# EAGLE schematic EEZ DIB DCM220 r2B8 (EAGLE 7.2.0)
Assembly variants: Farnell, TME

## Sheet 1 of 4: Bias PS, DIB interface
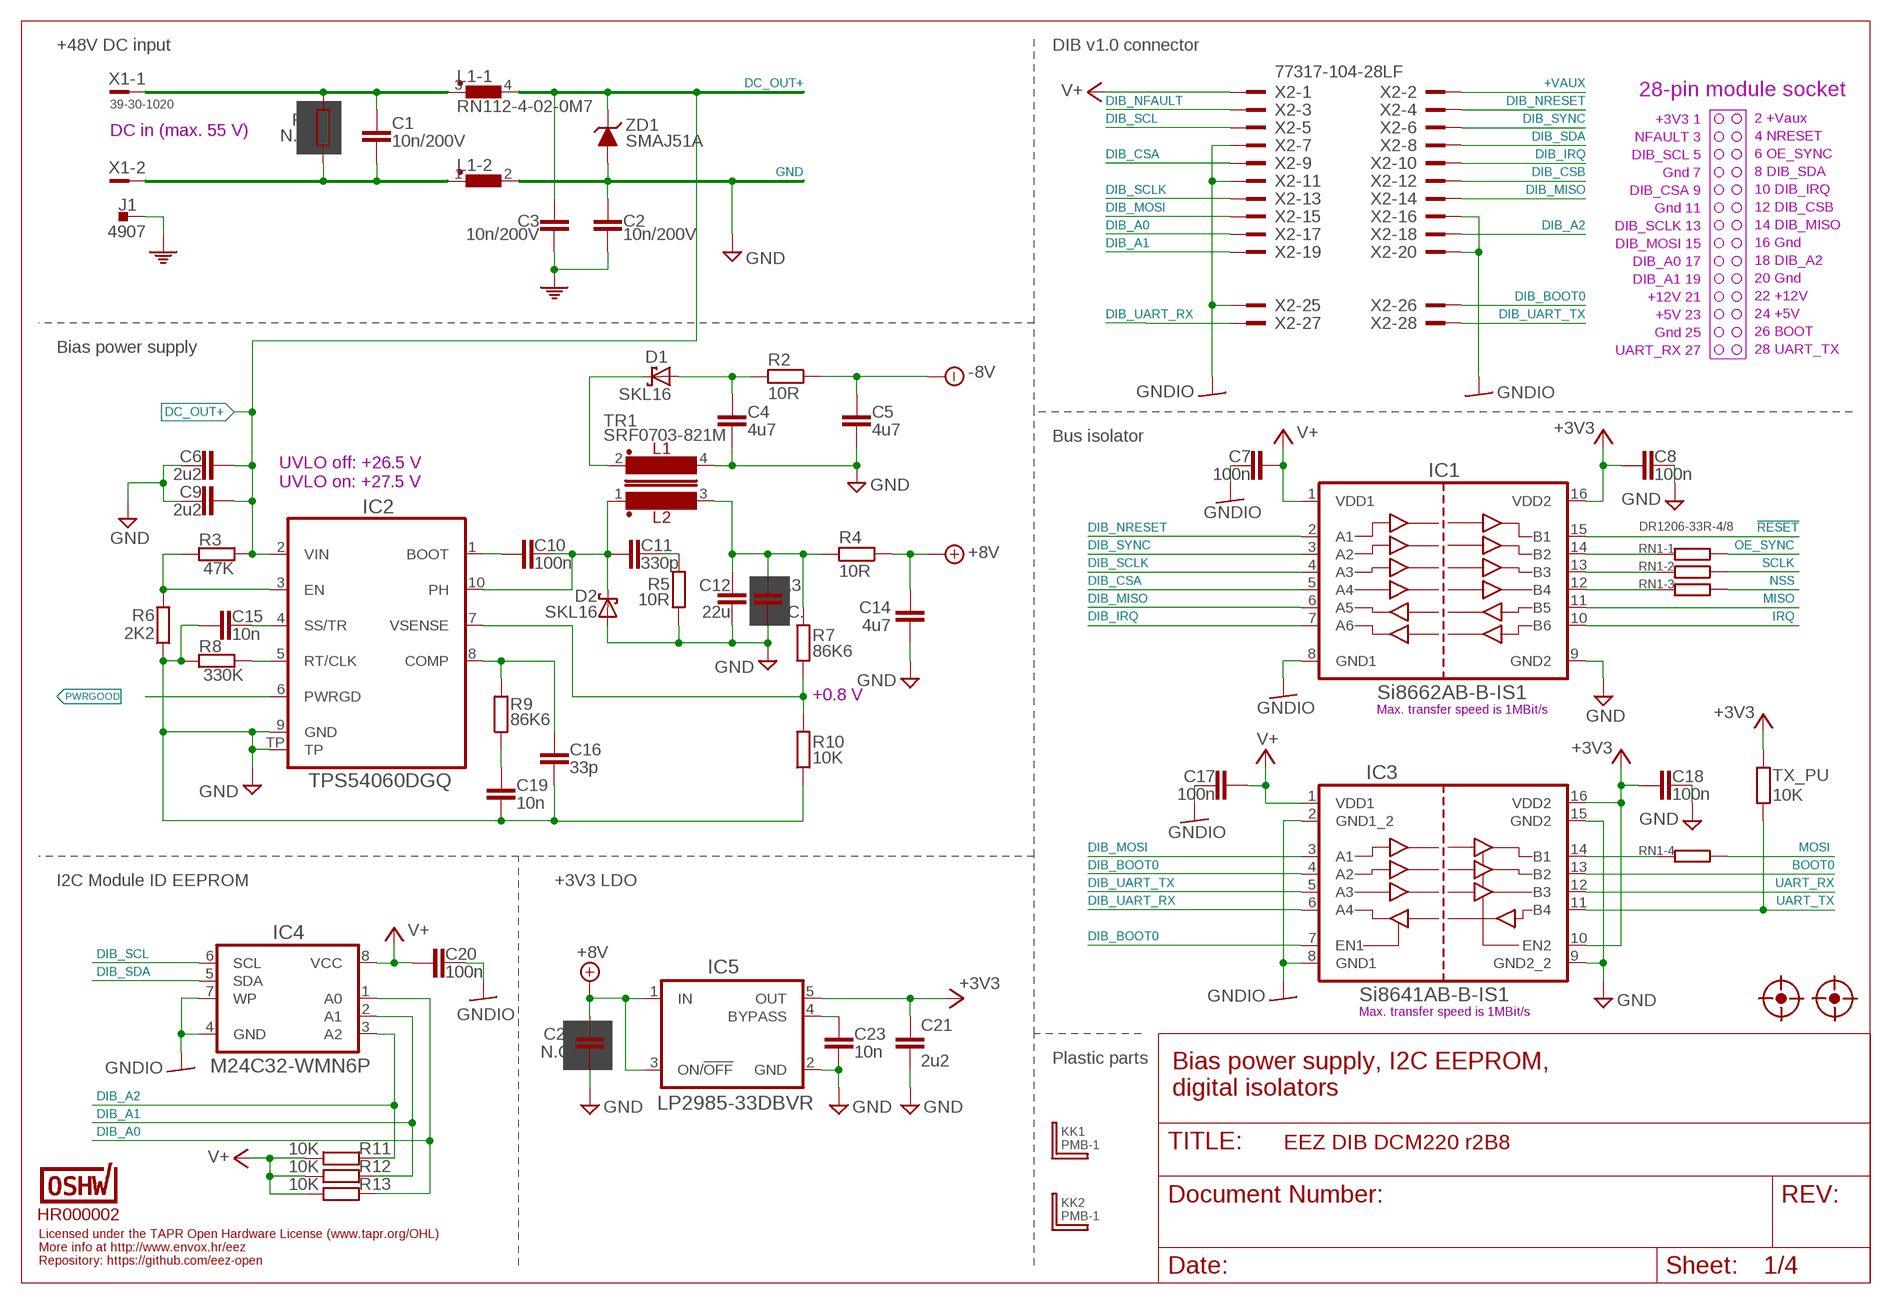
[diagram p0: schematic, sheet 1]

### Parts
C1  10n/200V  C-EUC1206  [C1206]
C2  10n/200V  C-EUC1206  [C1206]
C3  10n/200V  C-EUC1206  [C1206]
C4  4u7  C-EUC1206  [C1206]
C5  4u7  C-EUC1206  [C1206]
C6  2u2  C-EUC1206  [C1206]
C7  100n  C-EUC0603  [C0603]
C8  100n  C-EUC0603  [C0603]
C9  2u2  C-EUC1206  [C1206]
C10  100n  C-EUC0603  [C0603]
C11  330p  C-EUC0805  [C0805]
C12  22u  C-EUC1206  [C1206]
C13  N.C.  C-EUC1206  [C1206]
C14  4u7  C-EUC1206  [C1206]
C15  10n  C-EUC0805  [C0805]
C16  33p  C-EUC0603  [C0603]
C17  100n  C-EUC0603  [C0603]
C18  100n  C-EUC0603  [C0603]
C19  10n  C-EUC0805  [C0805]
C20  100n  C-EUC0603  [C0603]
C21  2u2  C-EUC1206  [C1206]
C22  N.C.  C-EUC0805  [C0805]
C23  10n  C-EUC0805  [C0805]
D1  SKL16  SCHOTTKYSOD123  [SOD123]
D2  SKL16  SCHOTTKYSOD123  [SOD123]
FM1  FIDUCIAL_2  [FIDUCIAL_DUAL]
FM2  FIDUCIAL_2  [FIDUCIAL_DUAL]
IC1  Si8662AB-B-IS1  SI8662NSOIC-16  [SOIC-16]
IC2  TPS54060DGQ  [SOP50P490X110-11N]
IC3  Si8641AB-B-IS1  SI8641NSOIC-16  [SOIC-16]
IC4  M24C32-WMN6P  AT24CXXSOIC8  [SOIC127P600X173-8N]
IC5  LP2985-33DBVR  LP2985  [SOT95P270X145-5N]
J1  4907  PCB_TAB-4907  [PCB_TAB-4907]
KK1  PMB-1  PCB-MB  [PCB-MB]
KK2  PMB-1  PCB-MB  [PCB-MB]
L1  RN112-4-02-0M7  RN112  [RN112]
R1  N.C.  R-EU_R2512  [R2512]
R2  10R  R-EU_R0805  [R0805]
R3  47K  R-EU_R0805  [R0805]
R4  10R  R-EU_R0805  [R0805]
R5  10R  R-EU_R0805  [R0805]
R6  2K2  R-EU_R0805  [R0805]
R7  86K6  R-EU_R0805  [R0805]
R8  330K  R-EU_R0805  [R0805]
R9  86K6  R-EU_R0805  [R0805]
R10  10K  R-EU_R0805  [R0805]
R11  10K  R-EU_R0805  [R0805]
R12  10K  R-EU_R0805  [R0805]
R13  10K  R-EU_R0805  [R0805]
RN1  DR1206-33R-4/8  R_ARRAY4  [CAY16]
TR1  SRF0703-821M  BOURNS_SRF0703INV  [SRF0703]
TX_PU  10K  R-EU_R0805  [R0805]
U$3  HR000002  CERT-SMALL  [CERT-SMALL-SILK]
X1  39-30-1020  MINIFIT_39301020  [MINIFIT_39301020]
X2  77317-104-28LF  [77317-104-28LF]
ZD1  SMAJ51A  P6SMB68A  [DO214AA]

### Nets
!RESET: IC1.15(B1) ; also sheet 2
+3V3: C8.2 C18.2 C21.1 IC1.16(VDD2) IC3.10(EN2) IC3.16(VDD2) IC5.5(OUT) TX_PU.2 ; also sheet 2,3,4
+8V: C14.1 C22.2 IC5.1(IN) IC5.3(ON/!OFF) R4.1 ; also sheet 3,4
+VAUX: X2.2
-8V: C5.1 R2.1 ; also sheet 3
BOOT0: IC3.13(B2) ; also sheet 2
DC+: C1.2 L1.3 R1.2 X1.1
DC-: C1.1 L1.1 R1.1 X1.2
DC_OUT+: C3.2 C6.1 C9.1 IC2.2(VIN) L1.4 R3.2 ZD1.C ; also sheet 3,4
DIB_A0: IC4.1(A0) R13.2 X2.17
DIB_A1: IC4.2(A1) R12.2 X2.19
DIB_A2: IC4.3(A2) R11.2 X2.18
DIB_BOOT0: IC3.4(A2) IC3.7(EN1) X2.26
DIB_CSA: IC1.5(A4) X2.9
DIB_CSB: X2.12
DIB_IRQ: IC1.7(A6) X2.10
DIB_MISO: IC1.6(A5) X2.14
DIB_MOSI: IC3.3(A1) X2.15
DIB_NFAULT: X2.3
DIB_NRESET: IC1.2(A1) X2.4
DIB_SCL: IC4.6(SCL) X2.5
DIB_SCLK: IC1.4(A3) X2.13
DIB_SDA: IC4.5(SDA) X2.8
DIB_SYNC: IC1.3(A2) X2.6
DIB_UART_RX: IC3.6(A4) X2.27
DIB_UART_TX: IC3.5(A3) X2.28
GND: C2.1 C4.2 C5.2 C6.2 C8.1 C9.2 C12.2 C13.2 C14.2 C15.2 C16.1 C18.1 C19.1 C21.2 C22.1 C23.1 D2.A IC1.9(GND2) IC2.9(GND) IC2.TP IC3.9(GND2_2) IC3.15(GND2) IC5.2(GND) L1.2 R5.1 R6.1 R8.1 R10.1 TR1.4 ZD1.A ; also sheet 2,3,4
GNDIO: C7.2 C17.2 C20.1 IC1.8(GND1) IC3.2(GND1_2) IC3.8(GND1) IC4.4(GND) IC4.7(WP) X2.7 X2.11 X2.16 X2.20 X2.25
IRQ: IC1.10(B6) ; also sheet 2
MISO: IC1.11(B5) ; also sheet 2
MOSI: RN1.5 ; also sheet 2
N$4: IC1.14(B2) RN1.1
N$6: IC1.13(B3) RN1.2
N$9: IC1.12(B4) RN1.3
N$10: IC3.14(B1) RN1.4
N$33: C23.2 IC5.4(BYPASS)
N$53: C4.1 D1.A R2.2
N$245: C11.2 R5.2
N$248: IC2.3(EN) R3.1 R6.2
N$268: C15.1 IC2.4(SS/TR)
N$269: IC2.5(RT/CLK) R8.2
N$274: C16.2 IC2.8(COMP) R9.2
N$276: C19.2 R9.1
N$316: C10.2 IC2.1(BOOT)
N$478: IC2.7(VSENSE) R7.1 R10.2
NSS: RN1.6 ; also sheet 2
OE_SYNC: RN1.8 ; also sheet 2
PE: C2.2 C3.1 J1.1 J1.2 ; also sheet 3,4
PH1: C10.1 C11.1 D2.C IC2.10(PH) TR1.1
PWRGOOD: IC2.6(PWRGD) ; also sheet 2
SCLK: RN1.7 ; also sheet 2
UART_RX: IC3.12(B3) ; also sheet 2
UART_TX: IC3.11(B4) TX_PU.1 ; also sheet 2
V+: C7.1 C17.1 C20.2 IC1.1(VDD1) IC3.1(VDD1) IC4.8(VCC) R11.1 R12.1 R13.1 X2.1
VOUT+: C12.1 C13.1 R4.2 R7.2 TR1.3
VOUT-: D1.C TR1.2
Unconnected: X2.21 X2.22 X2.23 X2.24

### Notes on the sheet
- +48V DC input | DIB v1.0 connector
- 28-pin module socket
- +3V3 1
- 2 +Vaux
- NFAULT 3
- DC in (max. 55 V)
- 4 NRESET
- DIB_SCL 5
- 6 OE_SYNC
- Gnd 7
- 8 DIB_SDA
- DIB_CSA 9
- 10 DIB_IRQ
- Gnd 11
- 12 DIB_CSB
- DIB_SCLK 13
- 14 DIB_MISO
- DIB_MOSI 15
- 16 Gnd
- DIB_A0 17
- 18 DIB_A2
- DIB_A1 19
- 20 Gnd
- +12V 21
- 22 +12V
- +5V 23
- 24 +5V
- Gnd 25
- 26 BOOT
- Bias power supply
- UART_RX 27
- 28 UART_TX
- Bus isolator
- UVLO off: +26.5 V
  UVLO on: +27.5 V
- +0.8 V
- Max. transfer speed is 1MBit/s
- I2C Module ID EEPROM | +3V3 LDO
- Max. transfer speed is 1MBit/s
- Plastic parts
- Bias power supply, I2C EEPROM,
  digital isolators
- Licensed under the TAPR Open Hardware License (www.tapr.org/OHL)
- More info at http://www.envox.hr/eez
- Repository: https://github.com/eez-open

## Sheet 2 of 4: Digital control
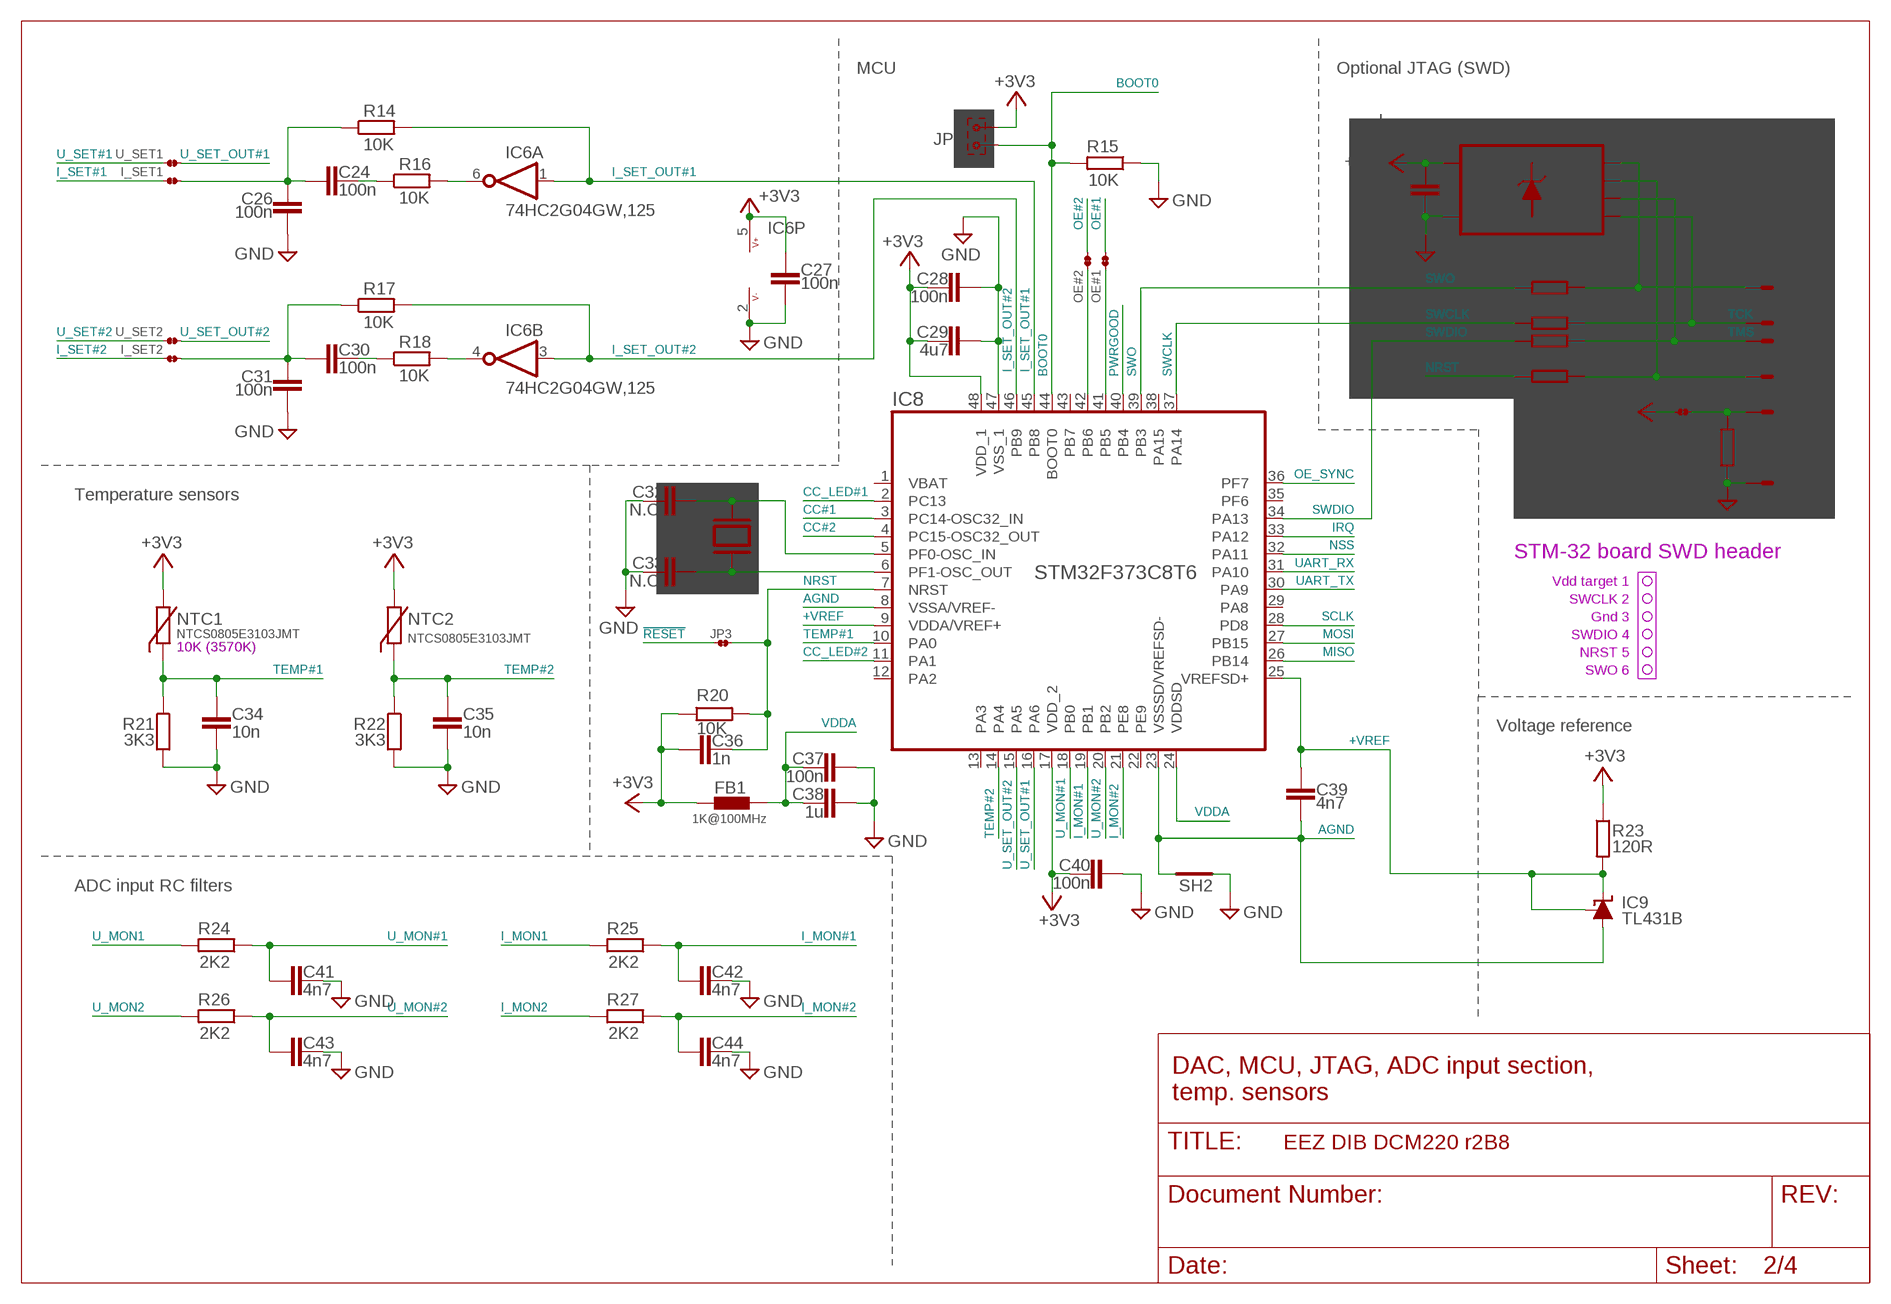
[diagram p1: schematic, sheet 2]

### Parts
C24  100n  C-EUC0603  [C0603]
C25  N.C.  C-EUC0603  [C0603]
C26  100n  C-EUC0603  [C0603]
C27  100n  C-EUC0603  [C0603]
C28  100n  C-EUC0603  [C0603]
C29  4u7  C-EUC1206  [C1206]
C30  100n  C-EUC0603  [C0603]
C31  100n  C-EUC0603  [C0603]
C32  N.C.  C-EUC0603  [C0603]
C33  N.C.  C-EUC0603  [C0603]
C34  10n  C-EUC0805  [C0805]
C35  10n  C-EUC0805  [C0805]
C36  1n  C-EUC0805  [C0805]
C37  100n  C-EUC0603  [C0603]
C38  1u  C-EUC0805  [C0805]
C39  4n7  C-EUC0805  [C0805]
C40  100n  C-EUC0603  [C0603]
C41  4n7  C-EUC0805  [C0805]
C42  4n7  C-EUC0805  [C0805]
C43  4n7  C-EUC0805  [C0805]
C44  4n7  C-EUC0805  [C0805]
FB1  1K@100MHz  FERRITE_BEAD0603  [BEAD0603]
I_SET1  JP2-NOCUT  [JP2-NOCUT]
I_SET2  JP2-NOCUT  [JP2-NOCUT]
IC6  74HC2G04GW,125  74HC2G04  [SOT65P210X110-6N]
IC7  N.C.  TPD4E001-DRL  [DRL6]
IC8  STM32F373C8T6  [LQFP-48]
IC9  TL431B  TL431  [SOT103P240X110-3N]
JP1  JUMPER-2PIN-2MM  [2MM-2]
JP2  JP2-CUT  [JP2-CUT]
JP3  JP2-NOCUT  [JP2-NOCUT]
NTC1  NTCS0805E3103JMT  NTCR_0805  [R_0805]
NTC2  NTCS0805E3103JMT  NTCR_0805  [R_0805]
OE#1  JP2-NOCUT  [JP2-NOCUT]
OE#2  JP2-NOCUT  [JP2-NOCUT]
R14  10K  R-EU_R0805  [R0805]
R15  10K  R-EU_R0805  [R0805]
R16  10K  R-EU_R0805  [R0805]
R17  10K  R-EU_R0805  [R0805]
R18  10K  R-EU_R0805  [R0805]
R19  N.C.  R-EU_R0805  [R0805]
R20  10K  R-EU_R0805  [R0805]
R21  3K3  R-EU_R0805  [R0805]
R22  3K3  R-EU_R0805  [R0805]
R23  120R  R-EU_R0805  [R0805]
R24  2K2  R-EU_R0805  [R0805]
R25  2K2  R-EU_R0805  [R0805]
R26  2K2  R-EU_R0805  [R0805]
R27  2K2  R-EU_R0805  [R0805]
RN2  N.C.  R_ARRAY4  [CAY16]
SH2  SHORTNOHOLE  [SHORT_NOHOLE]
U_SET1  JP2-NOCUT  [JP2-NOCUT]
U_SET2  JP2-NOCUT  [JP2-NOCUT]
X3  N.C.  22-23-2061  [22-23-2061]
Y1  N.C.  XTAL7.5X5.1-B  [12SMX(B)]

### Nets
!RESET: JP3.1 ; also sheet 1
+3V3: C25.1 C27.1 C28.2 C29.1 C36.2 C40.2 FB1.P$1 IC6.5(P:V+) IC7.6(VCC) IC8.17(VDD_2) IC8.48(VDD_1) JP1.1 JP2.1 NTC1.1 NTC2.1 R20.1 R23.1 ; also sheet 1,3,4
+VREF: C39.2 IC8.9(VDDA/VREF+) IC8.25(VREFSD+) IC9.1(C) IC9.2(R) R23.2
AGND: C39.1 IC8.8(VSSA/VREF-) IC8.23(VSSSD/VREFSD-) IC9.3(A) SH2.1(GND_A)
BOOT0: IC8.44(BOOT0) JP1.2 R15.2 ; also sheet 1
CC#1: IC8.3(PC14-OSC32_IN) ; also sheet 3
CC#2: IC8.4(PC15-OSC32_OUT) ; also sheet 4
CC_LED#1: IC8.2(PC13) ; also sheet 3
CC_LED#2: IC8.11(PA1) ; also sheet 4
GND: C25.2 C26.2 C27.2 C28.1 C29.2 C31.2 C32.1 C33.1 C34.1 C35.1 C37.1 C38.1 C40.1 C41.1 C42.1 C43.1 C44.1 IC6.2(P:V-) IC7.3(GND) IC8.47(VSS_1) R15.1 R19.1 R21.2 R22.2 SH2.2(GND_B) X3.3 ; also sheet 1,3,4
I_MON1: R25.2 ; also sheet 3
I_MON2: R27.2 ; also sheet 4
I_MON#1: C42.2 IC8.19(PB1) R25.1
I_MON#2: C44.2 IC8.21(PE8) R27.1
I_SET#1: I_SET1.1 ; also sheet 3
I_SET#2: I_SET2.1 ; also sheet 4
I_SET_OUT#1: IC6.1(A:I) IC8.45(PB8) R14.2
I_SET_OUT#2: IC6.3(B:I) IC8.46(PB9) R17.2
IRQ: IC8.33(PA12) ; also sheet 1
MISO: IC8.26(PB14) ; also sheet 1
MOSI: IC8.27(PB15) ; also sheet 1
N$40: C30.2 R18.1
N$44: C30.1 C31.1 I_SET2.2 R17.1
N$45: IC6.4(B:O) R18.2
N$49: IC7.1(IO1) RN2.8 X3.6
N$50: IC7.2(IO2) RN2.6 X3.5
N$51: JP2.2 R19.2 X3.1
N$246: C24.2 R16.1
N$247: C24.1 C26.1 I_SET1.2 R14.1
N$252: IC6.6(A:O) R16.2
N$481: IC8.42(PB6) OE#2.1
N$482: IC8.41(PB5) OE#1.1
NRST: C36.1 IC8.7(NRST) JP3.2 R20.2 RN2.3
NSS: IC8.32(PA11) ; also sheet 1
OE#1: OE#1.2 ; also sheet 3
OE#2: OE#2.2 ; also sheet 4
OE_SYNC: IC8.36(PF7) ; also sheet 1
PWRGOOD: IC8.40(PB4) ; also sheet 1
RCC_OSC_IN: C32.2 IC8.5(PF0-OSC_IN) Y1.3
RCC_OSC_OUT: C33.2 IC8.6(PF1-OSC_OUT) Y1.1
SCLK: IC8.28(PD8) ; also sheet 1
SWCLK: IC8.37(PA14) RN2.2
SWDIO: IC8.34(PA13) RN2.4
SWO: IC8.39(PB3) RN2.1
TCK: IC7.5(IO4) RN2.7 X3.2
TEMP#1: C34.2 IC8.10(PA0) NTC1.2 R21.1
TEMP#2: C35.2 IC8.14(PA4) NTC2.2 R22.1
TMS: IC7.4(IO3) RN2.5 X3.4
U_MON1: R24.2 ; also sheet 3
U_MON2: R26.2 ; also sheet 4
U_MON#1: C41.2 IC8.18(PB0) R24.1
U_MON#2: C43.2 IC8.20(PB2) R26.1
U_SET#1: U_SET1.1 ; also sheet 3
U_SET#2: U_SET2.1 ; also sheet 4
U_SET_OUT#1: IC8.16(PA6) U_SET1.2
U_SET_OUT#2: IC8.15(PA5) U_SET2.2
UART_RX: IC8.31(PA10) ; also sheet 1
UART_TX: IC8.30(PA9) ; also sheet 1
VDDA: C37.2 C38.2 FB1.P$2 IC8.24(VDDSD)
Unconnected: IC8.1(VBAT) IC8.12(PA2) IC8.13(PA3) IC8.22(PE9) IC8.29(PA8) IC8.35(PF6) IC8.38(PA15) IC8.43(PB7)

### Notes on the sheet
- MCU | Optional JTAG (SWD)
- Temperature sensors
- STM-32 board SWD header
- Vdd target 1
- SWCLK 2
- Gnd 3
- SWDIO 4
- NRST 5
- 10K (3570K)
- SWO 6
- Voltage reference
- ADC input RC filters
- DAC, MCU, JTAG, ADC input section,
  temp. sensors

## Sheet 3 of 4: Channel #1
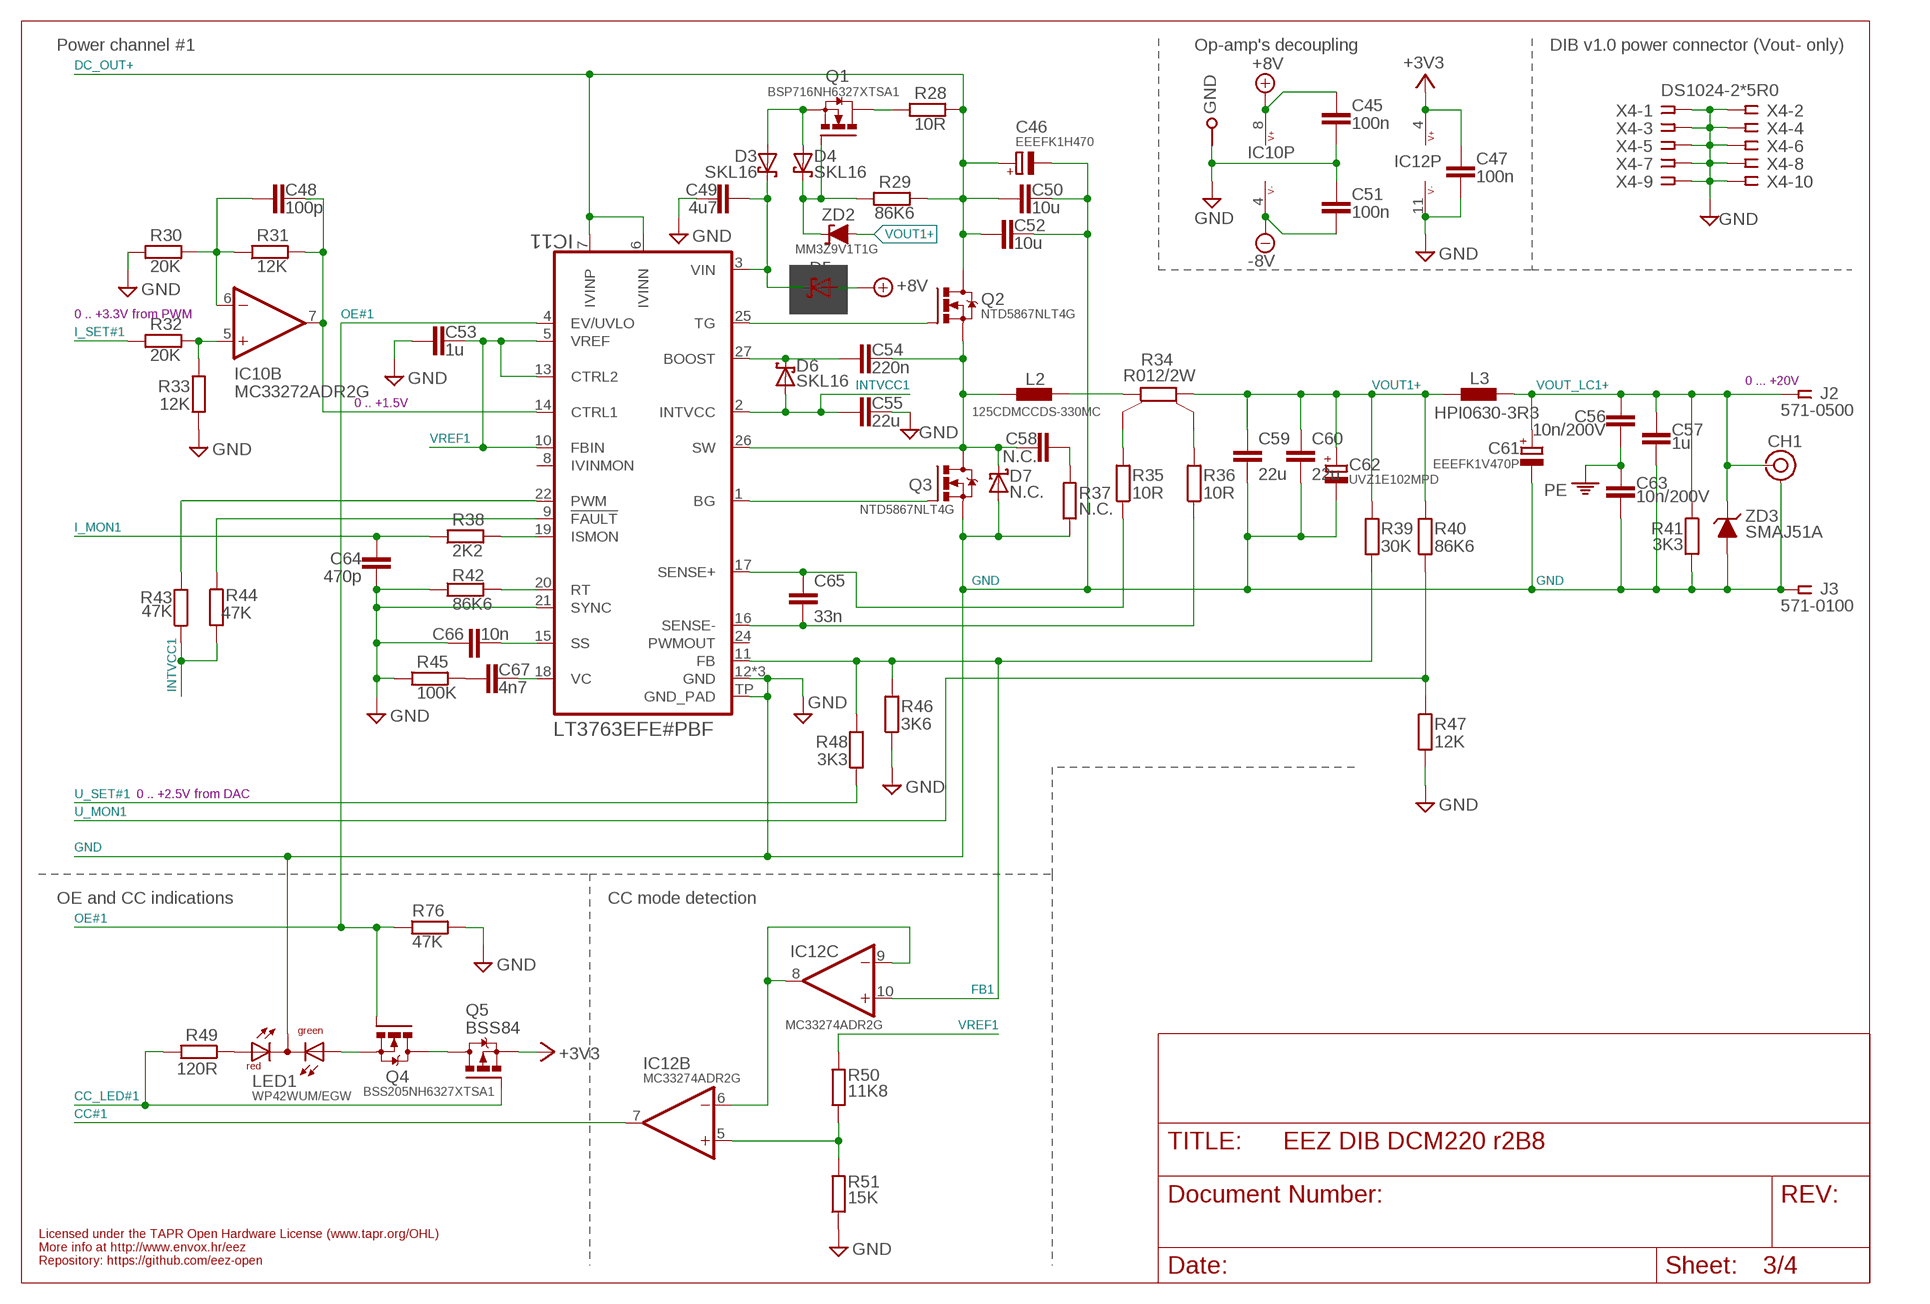
[diagram p2: schematic, sheet 3]

### Parts
C45  100n  C-EUC0603  [C0603]
C46  EEEFK1H470  ECAPSMD8.3MM/HA0  [CAPAE830X1050N]
C47  100n  C-EUC0603  [C0603]
C48  100p  C-EUC0805  [C0805]
C49  4u7  C-EUC1206  [C1206]
C50  10u  C-EUC1210  [C1210]
C51  100n  C-EUC0603  [C0603]
C52  10u  C-EUC1210  [C1210]
C53  1u  C-EUC0805  [C0805]
C54  220n  C-EUC0805  [C0805]
C55  22u  C-EUC1206  [C1206]
C56  10n/200V  C-EUC1206  [C1206]
C57  1u  C-EUC0805  [C0805]
C58  N.C.  C-EUC0805  [C0805]
C59  22u  C-EUC1210  [C1210]
C60  22u  C-EUC1210  [C1210]
C61  EEEFK1V470P  ECAPPANASONIC_H  [CAPAE660X610N]
C62  UVZ1E102MPD  ECAP5G_10.5MM  [ECAP5/10.5]
C63  10n/200V  C-EUC1206  [C1206]
C64  470p  C-EUC0805  [C0805]
C65  33n  C-EUC0805  [C0805]
C66  10n  C-EUC0805  [C0805]
C67  4n7  C-EUC0805  [C0805]
CH1  TEST_POINT-2  [TP_1.1MM_2]
D3  SKL16  SCHOTTKYSOD123  [SOD123]
D4  SKL16  SCHOTTKYSOD123  [SOD123]
D5  N.C.  SCHOTTKYSOD123  [SOD123]
D6  SKL16  SCHOTTKYSOD123  [SOD123]
D7  N.C.  SCHOTTKYSMA_DO-214AC  [SMA]
GND  TEST-PIN_0.9MM  [TEST-PIN_0.9MM]
IC10  MC33272ADR2G  TL072SOIC8  [SOIC127P600X173-8N]
IC11  LT3763EFE#PBF  [LTC_05-08-1663-EB]
IC12  MC33274ADR2G  TL074SOIC14  [SOIC127P600X175-14N]
J2  571-0500  [DELTRON_571]
J3  571-0100  [DELTRON_571]
L2  125CDMCCDS-330MC  125CDMCC/DS  [125CDMCC/DS]
L3  HPI0630-3R3  COILCRAFT_HPI0630  [COILCRAFT_HPI0630]
LED1  WP42WUM/EGW  LED_L-42WUM/1EGWT  [L-42WUM-1EGWT]
Q1  BSP716NH6327XTSA1  N-HEXFET-2D_SOT232-IRLL014N  [SOT223]
Q2  NTD5867NLT4G  N-MOSFETDPAK  [TO229P990X239-3N]
Q3  NTD5867NLT4G  N-MOSFETDPAK  [TO229P990X239-3N]
Q4  BSS205NH6327XTSA1  2N7002  [SOT103P240X110-3N]
Q5  BSS84  IRLML2246TRPBF  [SOT95P237X112-3N]
R28  10R  R-EU_R0805  [R0805]
R29  86K6  R-EU_R0805  [R0805]
R30  20K  R-EU_R0805  [R0805]
R31  12K  R-EU_R0805  [R0805]
R32  20K  R-EU_R0805  [R0805]
R33  12K  R-EU_R0805  [R0805]
R34  R012/2W  R-EU_4WIRE2512  [R_2512-4WIRE]
R35  10R  R-EU_R0805  [R0805]
R36  10R  R-EU_R0805  [R0805]
R37  N.C.  R-EU_R1206  [R1206]
R38  2K2  R-EU_R0805  [R0805]
R39  30K  R-EU_R0805  [R0805]
R40  86K6  R-EU_R0805  [R0805]
R41  3K3  R-EU_R0805  [R0805]
R42  86K6  R-EU_R0805  [R0805]
R43  47K  R-EU_R0805  [R0805]
R44  47K  R-EU_R0805  [R0805]
R45  100K  R-EU_R0805  [R0805]
R46  3K6  R-EU_R0805  [R0805]
R47  12K  R-EU_R0805  [R0805]
R48  3K3  R-EU_R0805  [R0805]
R49  120R  R-EU_R0805  [R0805]
R50  11K8  R-EU_R0805  [R0805]
R51  15K  R-EU_R0805  [R0805]
R76  47K  R-EU_R0805  [R0805]
X4  DS1024-2*5R0  SSW-105-02-T-D-RA  [SSW-105-02-T-D-RA]
ZD2  MM3Z9V1T1G  ZENER-DIODESOD323  [SOD323-W]
ZD3  SMAJ51A  P6SMB68A  [DO214AA]

### Nets
+3V3: C47.1 IC12.4(P:V+) Q5.2(S) ; also sheet 1,2,4
+8V: C45.1 D5.A IC10.8(P:V+) ; also sheet 1,4
-8V: C51.2 IC10.4(P:V-) ; also sheet 1
BG1: IC11.1(BG) Q3.1(G)
CC#1: IC12.7(B:OUT) ; also sheet 2
CC_LED#1: Q5.1(G) R49.2 ; also sheet 2
DC_OUT+: C46.+ C50.1 C52.1 IC11.6(IVINN) IC11.7(IVINP) Q2.2(D) R28.1 R29.1 ; also sheet 1,4
FB1: IC11.11(FB) IC12.10(C:+IN) R39.1 R46.2 R48.2
GND: C45.2 C46.- C47.2 C49.2 C50.2 C51.1 C52.2 C53.2 C55.2 C57.2 C59.2 C60.2 C61.2(-) C62.- C63.2 C64.1 C66.1 CH1.GND D7.A GND.1 IC11.12(GND) IC11.21(SYNC) IC11.23(GND) IC11.28(GND) IC11.TP(GND_PAD) IC12.11(P:V-) J3.1 J3.1.1 LED1.CC(C) Q3.3(S) R30.1 R33.1 R37.1 R41.2 R42.1 R45.1 R46.1 R47.1 R51.1 R76.2 X4.1 X4.2 X4.3 X4.4 X4.5 X4.6 X4.7 X4.8 X4.9 X4.10 ZD3.A ; also sheet 1,2,4
I_MON1: C64.2 R38.1 ; also sheet 2
I_SET#1: R32.1 ; also sheet 2
INTVCC1: C55.1 D6.A IC11.2(INTVCC) R43.1 R44.2
ISET1: C48.1 IC10.7(B:OUT) IC11.14(CTRL1) R31.2
LOUT1: L2.2 R34.1
N$3: Q4.3(D) Q5.3(D)
N$7: R34.1S R35.2
N$8: IC11.20(RT) R42.2
N$11: LED1.RED(AR) R49.1
N$12: C66.2 IC11.15(SS)
N$13: C67.1 R45.2
N$14: C67.2 IC11.18(VC)
N$16: R34.2S R36.2
N$17: C58.2 R37.2
N$18: IC11.9(!FAULT) R44.1
N$22: C54.1 D6.C IC11.27(BOOST)
N$26: D4.C Q1.1(G) R29.2 ZD2.C
N$27: LED1.GREEN(AG) Q4.2(S)
N$39: C49.1 D3.C D5.C IC11.3(VIN)
N$43: D3.A D4.A Q1.3(S)
N$48: IC11.19(ISMON) R38.2
N$54: IC12.5(B:+IN) R50.1 R51.2
N$55: IC12.6(B:-IN) IC12.8(C:OUT) IC12.9(C:-IN)
N$250: IC10.5(B:+IN) R32.2 R33.2
N$251: C48.2 IC10.6(B:-IN) R30.2 R31.1
OE#1: IC11.4(EV/UVLO) Q4.1(G) R76.1 ; also sheet 2
PE: C56.1 C63.1 ; also sheet 1,4
PWM#1: IC11.22(PWM) R43.2
Q1D: Q1.2(D) Q1.4(D) R28.2
SENSE1+: C65.1 IC11.17(SENSE+) R35.1
SENSE1-: C65.2 IC11.16(SENSE-) R36.1
SW1: C54.2 C58.1 D7.C IC11.26(SW) L2.1 Q2.3(S) Q3.2(D)
TG1: IC11.25(TG) Q2.1(G)
U_MON1: R40.1 R47.2 ; also sheet 2
U_SET#1: R48.1 ; also sheet 2
VOUT1+: C59.1 C60.1 C62.+ L3.1 R34.2 R39.2 R40.2 ZD2.A
VOUT_LC1+: C56.2 C57.1 C61.1(+) CH1.TIP J2.1 J2.1.1 L3.2 R41.1 ZD3.C
VREF1: C53.1 IC11.5(VREF) IC11.10(FBIN) IC11.13(CTRL2) R50.2
Unconnected: IC11.8(IVINMON) IC11.24(PWMOUT)

### Notes on the sheet
- Power channel #1 | Op-amp's decoupling | DIB v1.0 power connector (Vout- only)
- 0 .. +3.3V from PWM
- 0 ... +20V
- 0 .. +1.5V
- 0 .. +2.5V from DAC
- OE and CC indications | CC mode detection
- Licensed under the TAPR Open Hardware License (www.tapr.org/OHL)
- More info at http://www.envox.hr/eez
- Repository: https://github.com/eez-open

## Sheet 4 of 4: Channel #2
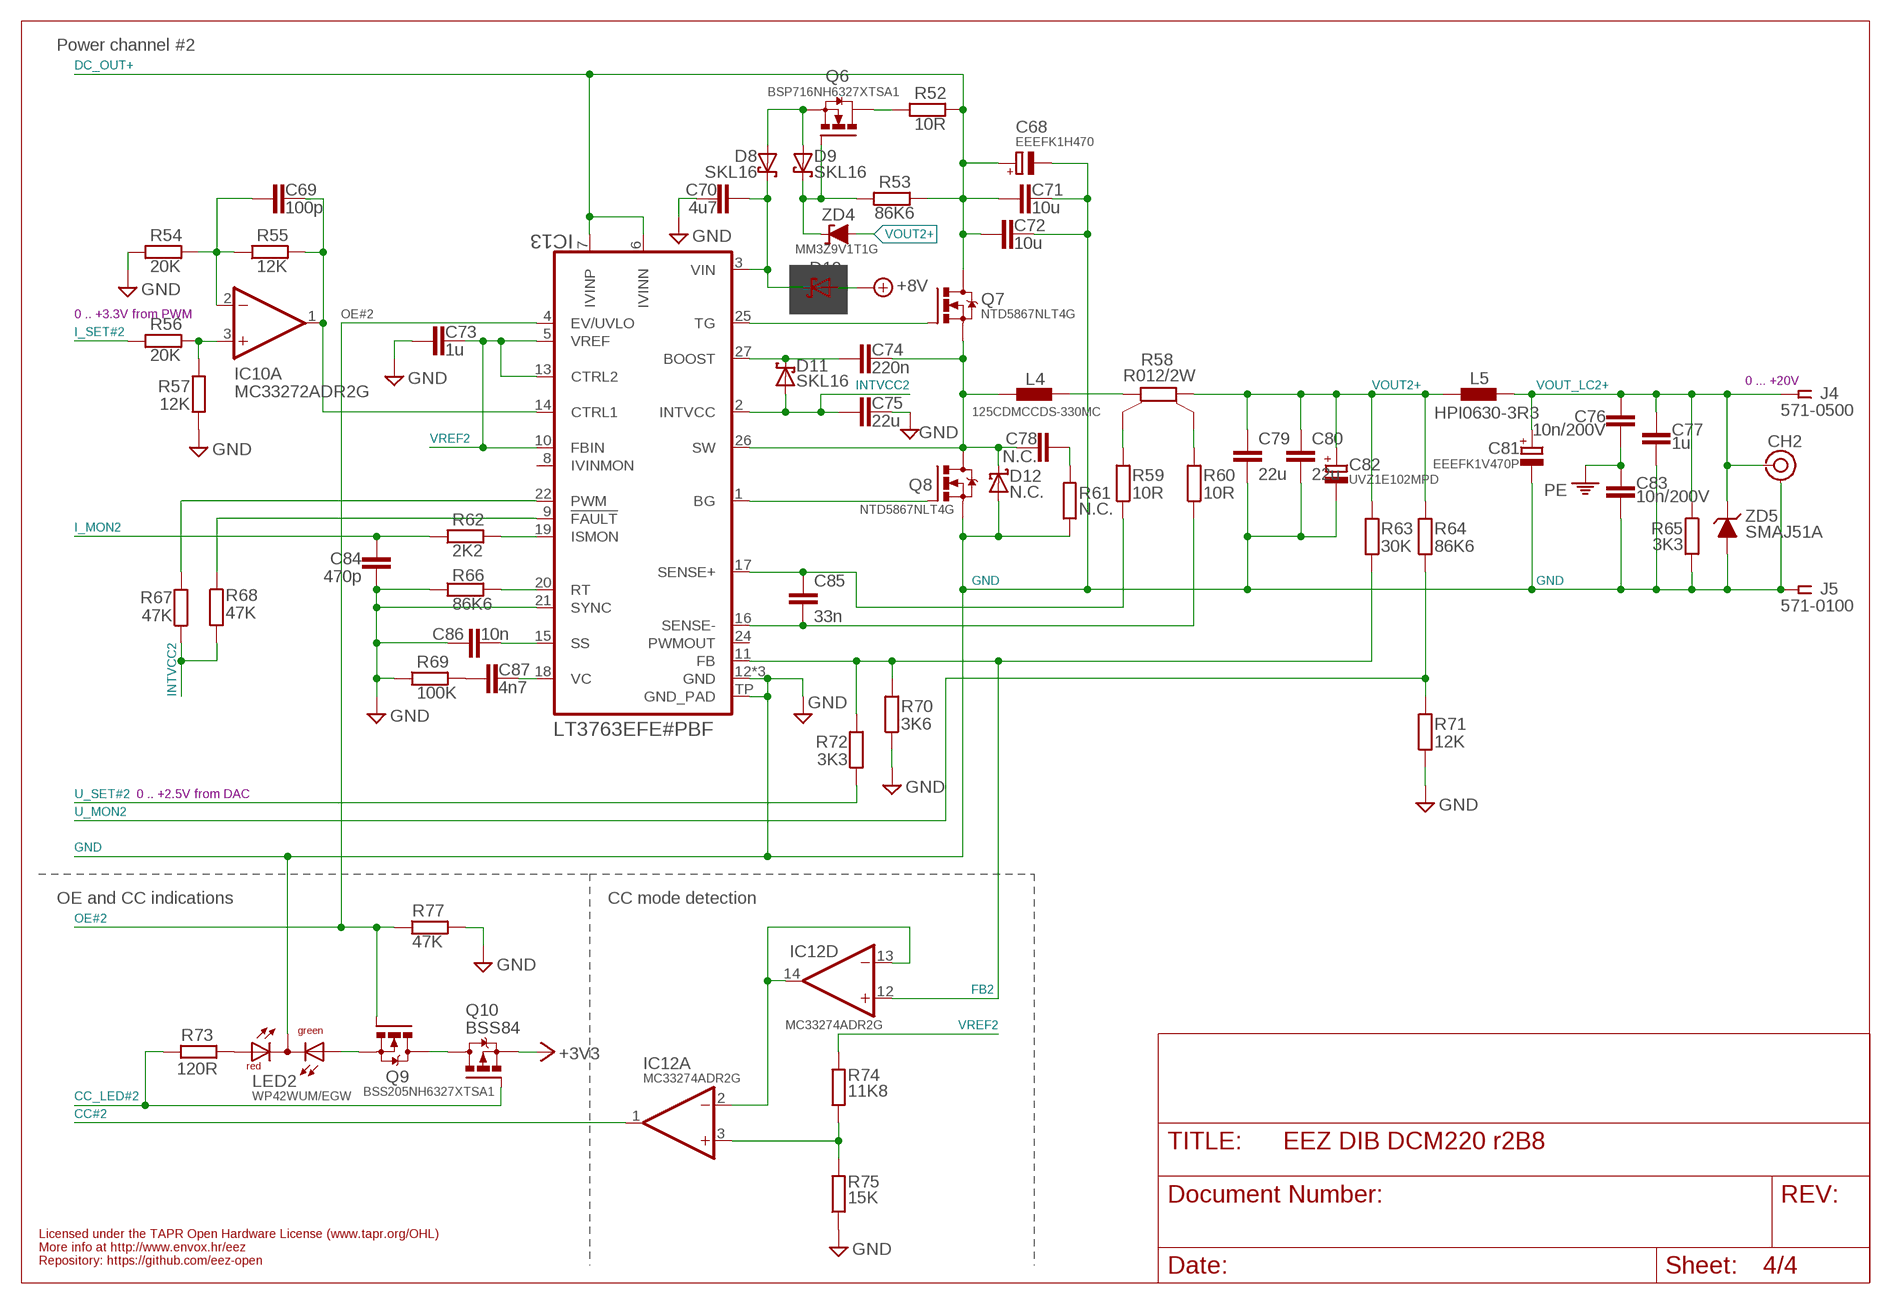
[diagram p3: schematic, sheet 4]

### Parts
C68  EEEFK1H470  ECAPSMD8.3MM/HA0  [CAPAE830X1050N]
C69  100p  C-EUC0805  [C0805]
C70  4u7  C-EUC1206  [C1206]
C71  10u  C-EUC1210  [C1210]
C72  10u  C-EUC1210  [C1210]
C73  1u  C-EUC0805  [C0805]
C74  220n  C-EUC0805  [C0805]
C75  22u  C-EUC1206  [C1206]
C76  10n/200V  C-EUC1206  [C1206]
C77  1u  C-EUC0805  [C0805]
C78  N.C.  C-EUC0805  [C0805]
C79  22u  C-EUC1210  [C1210]
C80  22u  C-EUC1210  [C1210]
C81  EEEFK1V470P  ECAPPANASONIC_H  [CAPAE660X610N]
C82  UVZ1E102MPD  ECAP5G_10.5MM  [ECAP5/10.5]
C83  10n/200V  C-EUC1206  [C1206]
C84  470p  C-EUC0805  [C0805]
C85  33n  C-EUC0805  [C0805]
C86  10n  C-EUC0805  [C0805]
C87  4n7  C-EUC0805  [C0805]
CH2  TEST_POINT-2  [TP_1.1MM_2]
D8  SKL16  SCHOTTKYSOD123  [SOD123]
D9  SKL16  SCHOTTKYSOD123  [SOD123]
D10  N.C.  SCHOTTKYSOD123  [SOD123]
D11  SKL16  SCHOTTKYSOD123  [SOD123]
D12  N.C.  SCHOTTKYSMA_DO-214AC  [SMA]
IC13  LT3763EFE#PBF  [LTC_05-08-1663-EB]
J4  571-0500  [DELTRON_571]
J5  571-0100  [DELTRON_571]
L4  125CDMCCDS-330MC  125CDMCC/DS  [125CDMCC/DS]
L5  HPI0630-3R3  COILCRAFT_HPI0630  [COILCRAFT_HPI0630]
LED2  WP42WUM/EGW  LED_L-42WUM/1EGWT  [L-42WUM-1EGWT]
Q6  BSP716NH6327XTSA1  N-HEXFET-2D_SOT232-IRLL014N  [SOT223]
Q7  NTD5867NLT4G  N-MOSFETDPAK  [TO229P990X239-3N]
Q8  NTD5867NLT4G  N-MOSFETDPAK  [TO229P990X239-3N]
Q9  BSS205NH6327XTSA1  2N7002  [SOT103P240X110-3N]
Q10  BSS84  IRLML2246TRPBF  [SOT95P237X112-3N]
R52  10R  R-EU_R0805  [R0805]
R53  86K6  R-EU_R0805  [R0805]
R54  20K  R-EU_R0805  [R0805]
R55  12K  R-EU_R0805  [R0805]
R56  20K  R-EU_R0805  [R0805]
R57  12K  R-EU_R0805  [R0805]
R58  R012/2W  R-EU_4WIRE2512  [R_2512-4WIRE]
R59  10R  R-EU_R0805  [R0805]
R60  10R  R-EU_R0805  [R0805]
R61  N.C.  R-EU_R1206  [R1206]
R62  2K2  R-EU_R0805  [R0805]
R63  30K  R-EU_R0805  [R0805]
R64  86K6  R-EU_R0805  [R0805]
R65  3K3  R-EU_R0805  [R0805]
R66  86K6  R-EU_R0805  [R0805]
R67  47K  R-EU_R0805  [R0805]
R68  47K  R-EU_R0805  [R0805]
R69  100K  R-EU_R0805  [R0805]
R70  3K6  R-EU_R0805  [R0805]
R71  12K  R-EU_R0805  [R0805]
R72  3K3  R-EU_R0805  [R0805]
R73  120R  R-EU_R0805  [R0805]
R74  11K8  R-EU_R0805  [R0805]
R75  15K  R-EU_R0805  [R0805]
R77  47K  R-EU_R0805  [R0805]
ZD4  MM3Z9V1T1G  ZENER-DIODESOD323  [SOD323-W]
ZD5  SMAJ51A  P6SMB68A  [DO214AA]

### Nets
+3V3: Q10.2(S) ; also sheet 1,2,3
+8V: D10.A ; also sheet 1,3
BG2: IC13.1(BG) Q8.1(G)
CC#2: IC12.1(A:OUT) ; also sheet 2
CC_LED#2: Q10.1(G) R73.2 ; also sheet 2
DC_OUT+: C68.+ C71.1 C72.1 IC13.6(IVINN) IC13.7(IVINP) Q7.2(D) R52.1 R53.1 ; also sheet 1,3
FB2: IC12.12(D:+IN) IC13.11(FB) R63.1 R70.2 R72.2
GND: C68.- C70.2 C71.2 C72.2 C73.2 C75.2 C77.2 C79.2 C80.2 C81.2(-) C82.- C83.2 C84.1 C86.1 CH2.GND D12.A IC13.12(GND) IC13.21(SYNC) IC13.23(GND) IC13.28(GND) IC13.TP(GND_PAD) J5.1 J5.1.1 LED2.CC(C) Q8.3(S) R54.1 R57.1 R61.1 R65.2 R66.1 R69.1 R70.1 R71.1 R75.1 R77.2 ZD5.A ; also sheet 1,2,3
I_MON2: C84.2 R62.1 ; also sheet 2
I_SET#2: R56.1 ; also sheet 2
INTVCC2: C75.1 D11.A IC13.2(INTVCC) R67.1 R68.2
ISET2: C69.1 IC10.1(A:OUT) IC13.14(CTRL1) R55.2
LOUT2: L4.2 R58.1
N$25: LED2.RED(AR) R73.1
N$28: IC13.20(RT) R66.2
N$36: C86.2 IC13.15(SS)
N$37: C87.1 R69.2
N$38: Q9.3(D) Q10.3(D)
N$41: LED2.GREEN(AG) Q9.2(S)
N$42: C70.1 D8.C D10.C IC13.3(VIN)
N$46: D9.C Q6.1(G) R53.2 ZD4.C
N$61: D8.A D9.A Q6.3(S)
N$249: C87.2 IC13.18(VC)
N$253: IC13.9(!FAULT) R68.1
N$261: R58.1S R59.2
N$262: R58.2S R60.2
N$263: C78.2 R61.2
N$264: C74.1 D11.C IC13.27(BOOST)
N$267: IC13.19(ISMON) R62.2
N$270: IC12.2(A:-IN) IC12.13(D:-IN) IC12.14(D:OUT)
N$271: IC12.3(A:+IN) R74.1 R75.2
N$278: C69.2 IC10.2(A:-IN) R54.2 R55.1
N$311: IC10.3(A:+IN) R56.2 R57.2
OE#2: IC13.4(EV/UVLO) Q9.1(G) R77.1 ; also sheet 2
PE: C76.1 C83.1 ; also sheet 1,3
PWM#2: IC13.22(PWM) R67.2
Q6D: Q6.2(D) Q6.4(D) R52.2
SENSE1+1: C85.1 IC13.17(SENSE+) R59.1
SENSE1-1: C85.2 IC13.16(SENSE-) R60.1
SW2: C74.2 C78.1 D12.C IC13.26(SW) L4.1 Q7.3(S) Q8.2(D)
TG2: IC13.25(TG) Q7.1(G)
U_MON2: R64.1 R71.2 ; also sheet 2
U_SET#2: R72.1 ; also sheet 2
VOUT2+: C79.1 C80.1 C82.+ L5.1 R58.2 R63.2 R64.2 ZD4.A
VOUT_LC2+: C76.2 C77.1 C81.1(+) CH2.TIP J4.1 J4.1.1 L5.2 R65.1 ZD5.C
VREF2: C73.1 IC13.5(VREF) IC13.10(FBIN) IC13.13(CTRL2) R74.2
Unconnected: IC13.8(IVINMON) IC13.24(PWMOUT)

### Notes on the sheet
- Power channel #2
- 0 .. +3.3V from PWM
- 0 ... +20V
- 0 .. +2.5V from DAC
- OE and CC indications | CC mode detection
- Licensed under the TAPR Open Hardware License (www.tapr.org/OHL)
- More info at http://www.envox.hr/eez
- Repository: https://github.com/eez-open

## Library data of the parts
C1-C45 C47-C60 C63-C67 C69-C80 C83-C87 = rcl:C-EU: CAPACITOR, European symbol
C46 C61 C62 C68 C81 C82 = EEZ_Lib1:ECAP
CH1 CH2 = EEZ_connectors:TEST_POINT: Test point for oscilloscope probe
D1-D12 = EEZ_Lib1:SCHOTTKY
FB1 = EEZ_Lib1:FERRITE_BEAD: FAIR-RITE - 2506033007Y3 - FERRITE BEAD, 0.04OHM, 3A, 0603 Farnell: 2112873
FM1 FM2 = EEZ_Lib1:FIDUCIAL: Fiducial mark for pick and place automation
GND = EEZ_connectors:TEST-PIN: Test pin
I_SET1 I_SET2 JP3 OE#1 OE#2 U_SET1 U_SET2 = EEZ_Lib1:JP2-NOCUT
IC1 = EEZ_Lib1:SI8662: Low power 6-ch digital isolator (4+2) Farnell: 2423351
IC2 = EEZ_Lib1:TPS54060: 0.5A, 60V Step Down SWIFT DC/DC Converter with ECO-MODE,MSOP-10; MPN: TPS54060ADGQ; OC_FARNELL: 2099922; OC_NEWARK: 05W5854; PACKAGE: MSOP-10; SUPPLIER: TEXAS INSTRUMENTS
IC3 = EEZ_Lib1:SI8641: Low power 4-ch digital isolator (3+1) Farnell: 2423288
IC4 = EEZ_Lib1:AT24CXX: I2C-Compatible (2-wire) Serial EEPROM
IC5 = EEZ_DIB:LP2985: 150-mA Low-noise Low-dropout Regulator With Shutdown
IC6 = EEZ_Lib1:74HC2G04: Dual inverter
IC7 = EEZ_Lib1:TPD4E001: Low-Capacitance 4-Channel ESD-Protection for High-Speed Data Interfaces
IC8 = EEZ_DIB:STM32F373: ARM®Cortex®-M4 32b MCU+FPU
IC9 = EEZ_Lib1:TL431: Precision programmable reference
IC10 = EEZ_Lib1:TL072
IC11 IC13 = EEZ_Lib1:LT3763: 60V High Current Step-Down LED Driver Controller
IC12 = EEZ_Lib1:TL074: LOW-NOISE JFET-INPUT OPERATIONAL AMPLIFIERS; MPN: TL074ACD; OC_FARNELL: 9593349; OC_NEWARK: 52F2748; PACKAGE: SOIC-14; SUPPLIER: Texas Instruments
J1 = EEZ_connectors:PCB_TAB: PCB quick-fit terminal
J2-J5 = EEZ_connectors:571-0: Socket; 4mm banana; 10A; 250VDC; silver plated; PCB; insulated
JP1 = EEZ_Lib1:JUMPER-2PIN
JP2 = EEZ_Lib1:JP2-CUT
KK1 KK2 = EEZ_Lib1:PCB-MB: Richo Mounting Block; 16 x 6 mm
L1 = EEZ_Lib1:RN112
L2 L4 = EEZ_inductors_and_transformers:125CDMCC/DS: Sumida SMD power inductor 13.8×12.9×5.0mm
L3 L5 = EEZ_inductors_and_transformers:COILCRAFT_HPI0630: High power inductor
LED1 LED2 = EEZ_Lib1:LED_L-42WUM/1EGWT: 3 mm right angle bicolor LED indicator
NTC1 NTC2 = EEZ_Lib1:NTC
Q1 Q6 = transistor-power:N-HEXFET-2D_?-*: HEXFET® Power MOSFET 2 Drain connects http://www.irf.com/product-info/datasheets/data/irll014n.pdf
Q2 Q3 Q7 Q8 = EEZ_Lib1:N-MOSFET
Q4 Q9 = EEZ_Lib1:2N7002: N-CHANNEL ENHANCEMENT MODE FIELD EFFECT TRANSISTOR; MPN: 2N7002-7-F; OC_FARNELL: 1713823; OC_NEWARK: 25R5679; PACKAGE: SOT-23-3; SUPPLIER: DIODES INC.
Q5 Q10 = EEZ_Lib1:IRLML2246TRPBF: HEXFET Power MOSFET (-20V, -2.6A); MPN: IRLML2246TRPBF; OC_FARNELL: 1888166; OC_NEWARK: 40T7450; PACKAGE: SOT-3; SUPPLIER: International Rectifier; TME: IRLML2246TRPBF
R1-R33 R35-R57 R59-R77 TX_PU = rcl:R-EU_: RESISTOR, European symbol
R34 R58 = EEZ_Lib1:R-EU_4WIRE
RN1 RN2 = EEZ_Lib1:R_ARRAY4: 1206 four resistor array
SH2 = EEZ_Lib1:SHORT
TR1 = EEZ_inductors_and_transformers:BOURNS_SRF0703INV: Bourns SRF0703 Series - Dual-Winding Shielded Power Inductors
U$3 = OSHWA:CERT
X1 = EEZ_connectors:MINIFIT_39301020: Molex Socket; wire-board; male; Mini-Fit Jr; 4.2mm; PIN:2; THT; PCB snap
X2 = EEZ_connectors:77317-104-28LF: Headers & Wire Housings 28P right angle 0.1" pitch
X3 = EEZ_connectors:22-23-2061: .100" (2.54mm) Center Header - 6 Pin; MF: MOLEX; MPN: 22-23-2061; OC_FARNELL: 1462922; OC_NEWARK: 27C1933
X4 = EEZ_connectors:SSW-105-02-T-D-RA: Samtec SSW-105-02-T-D-RA Connector, Receptacle, 2.54MM, RA, 10-way; FARNELL: 2308470
Y1 = EEZ_Lib1:XTAL
ZD1 ZD3 ZD5 = EEZ_Lib1:P6SMB68A: Transient Voltage Suppression Diodes, DO-214AA
ZD2 ZD4 = EEZ_Lib1:ZENER-DIODE

## Net classes
0 default: width 0.203 mm, drill 0.3 mm, clearance 0.203 mm
1 lvds: width 0.152 mm, drill 0.3 mm, clearance 0.152 mm to class 0, clearance 0.152 mm
2 gnd: width 0.254 mm, drill 0.584 mm, clearance 0.254 mm